# Altium schematic sheet conect_sheet.SchDoc
size 420 x 297 mm; DocumentNumber: Connectors
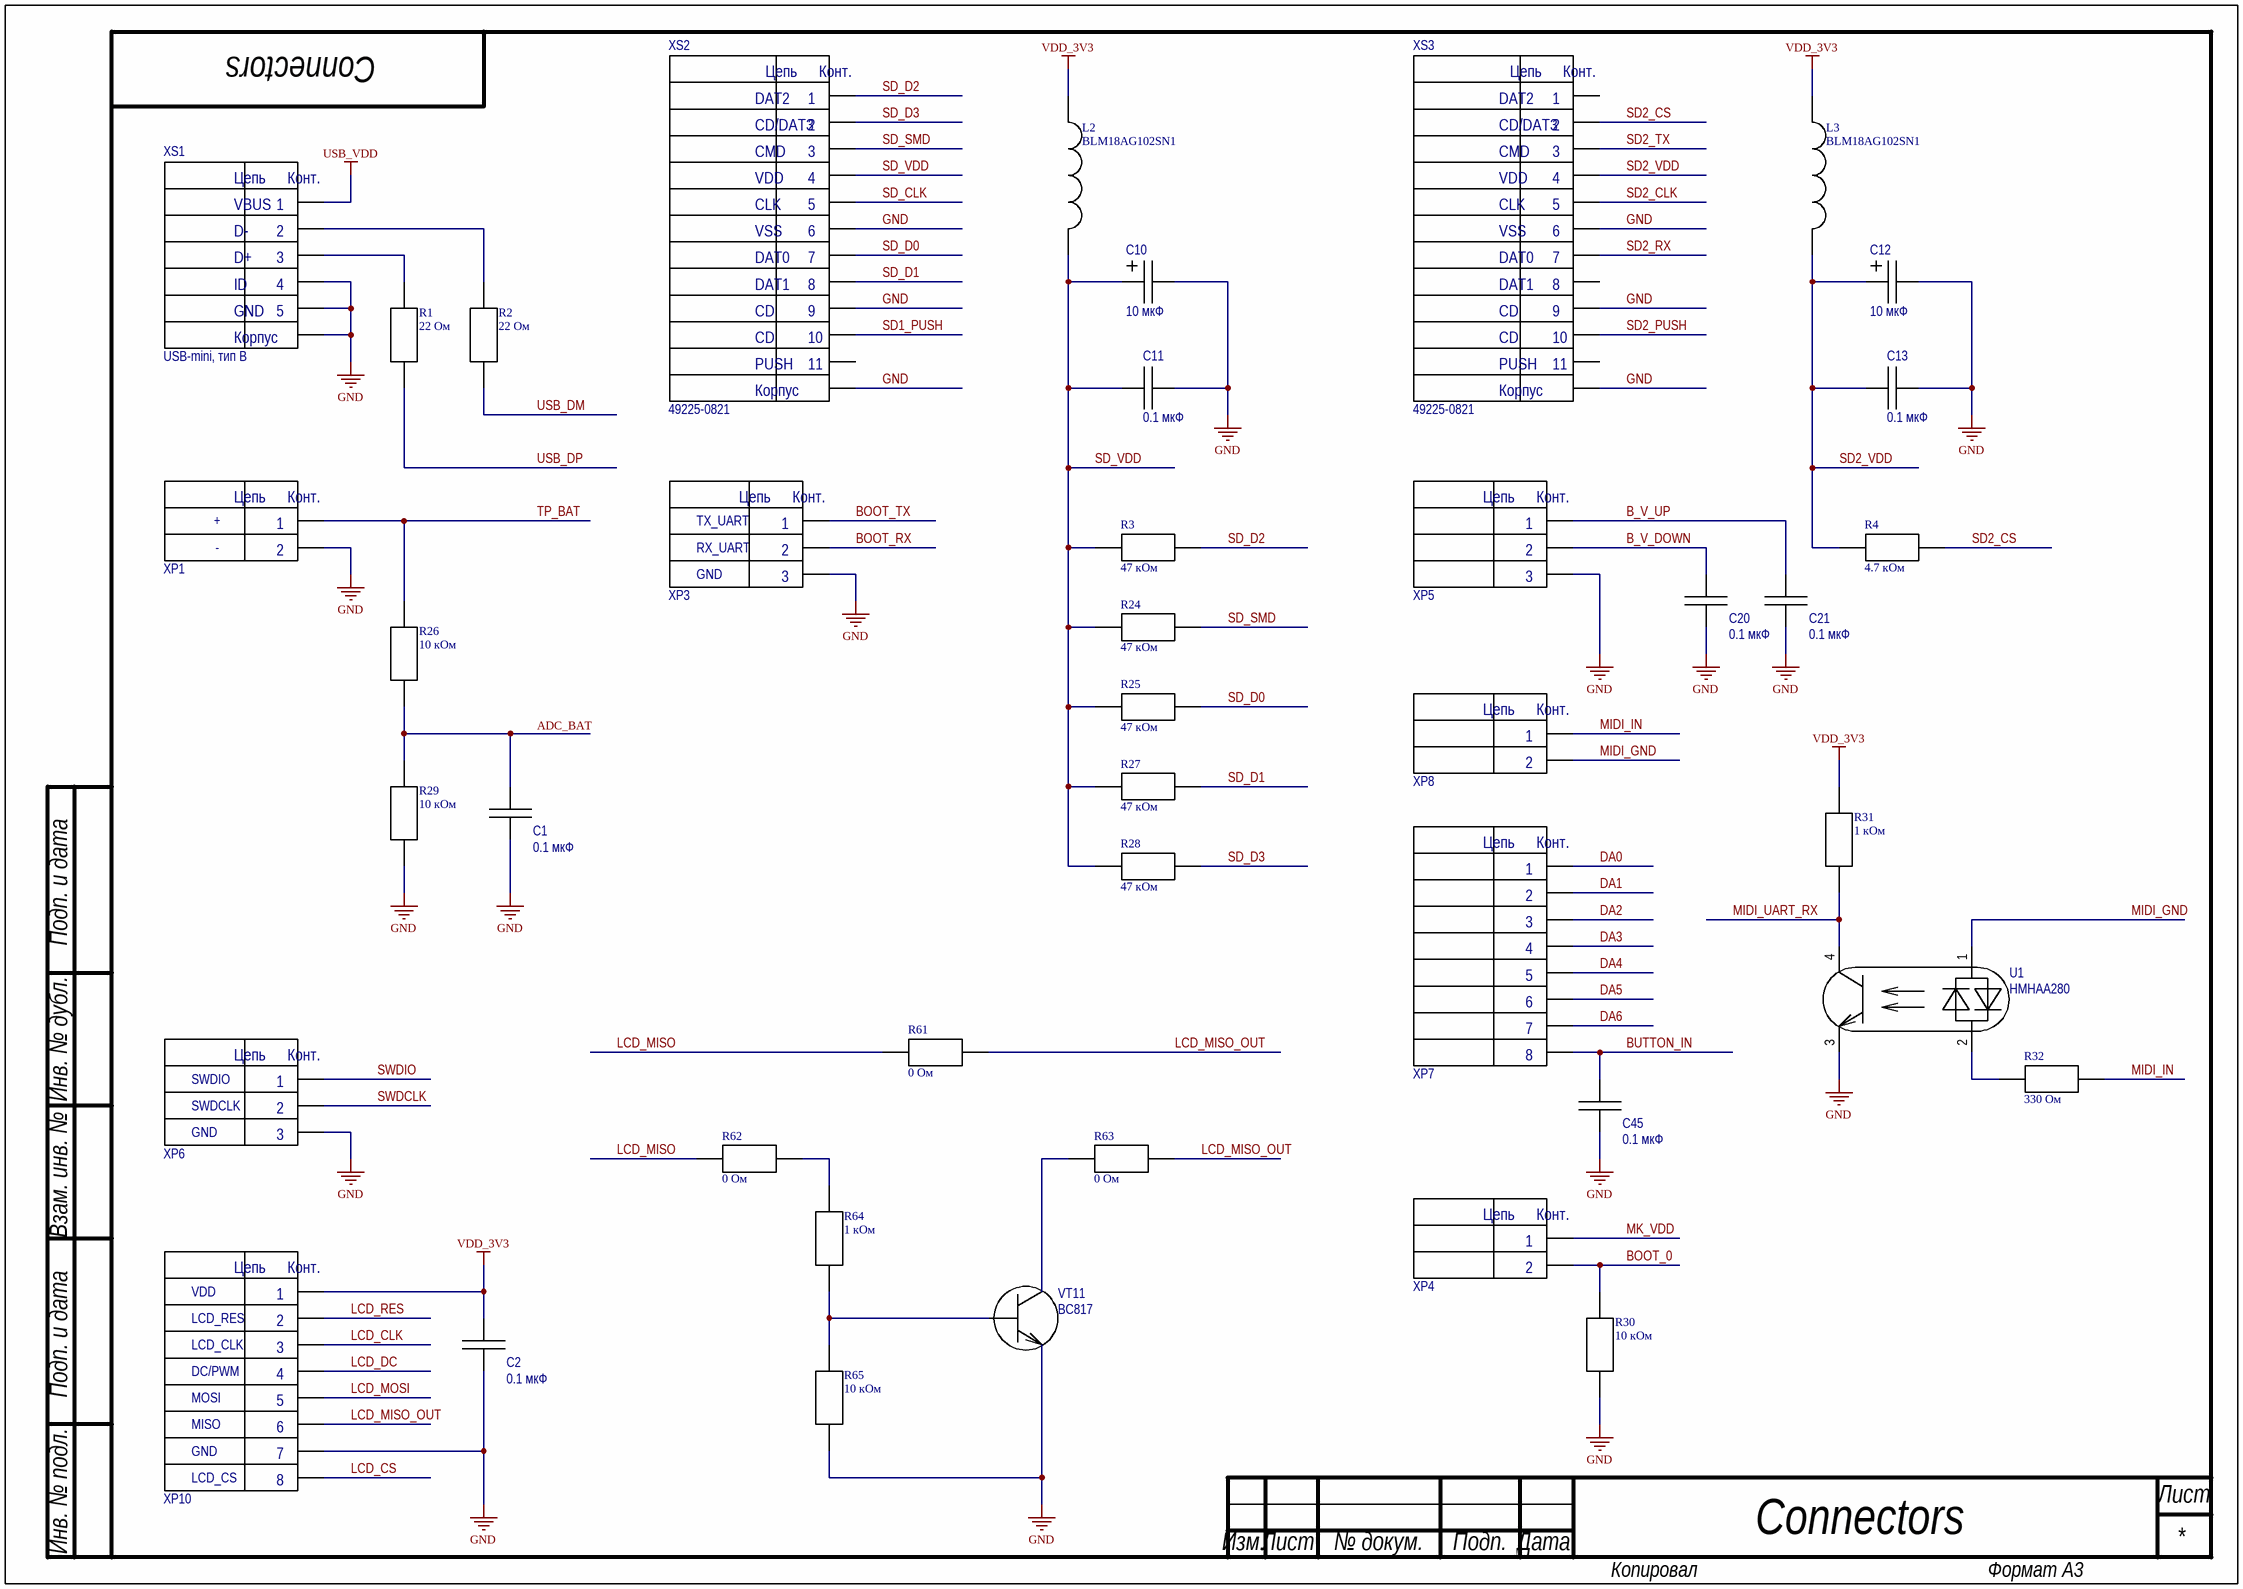
[diagram p0: conect_sheet.SchDoc]

## Parts
C1  0.1 мкФ  [C 1206]
C2  0.1 мкФ  [C 1206]
C10  10 мкФ  [C TAN_C]
C11  0.1 мкФ  [C 1206]
C12  10 мкФ  [C TAN_C]
C13  0.1 мкФ  [C 1206]
C20  0.1 мкФ  [C 1206]
C21  0.1 мкФ  [C 1206]
C45  0.1 мкФ  [C 1206]
L2  BLM18AG102SN1  [FB 0603]
L3  BLM18AG102SN1  [FB 0603]
R1  22 Ом  [RES 0805]
R2  22 Ом  [RES 0805]
R3  47 кОм  [RES 0805]
R4  4.7 кОм  [RES 0805]
R24  47 кОм  [RES 0805]
R25  47 кОм  [RES 0805]
R26  10 кОм  [RES 0805]
R27  47 кОм  [RES 0805]
R28  47 кОм  [RES 0805]
R29  10 кОм  [RES 0805]
R30  10 кОм  [RES 0805]
R31  1 кОм  [RES 0805]
R32  330 Ом  [RES 0805]
R61  0 Ом  [RES 0805]
R62  0 Ом  [RES 0805]
R63  0 Ом  [RES 0805]
R64  1 кОм  [RES 0805]
R65  10 кОм  [RES 0805]
U1  HMHAA280  [MFP-4L]
VT11  BC817  [SOT-23]
XP1  PLS-2  [PLS-2]  (value not drawn)
XP3  PLS-3  [PLS-3]  (value not drawn)
XP4  PLS-2  [PLS-2]  (value not drawn)
XP5  PLS-3  [PLS-3]  (value not drawn)
XP6  PLS-3  [PLS-3]  (value not drawn)
XP7  PLD-8  [PLD-8]  (value not drawn)
XP8  PLS-2  [PLS-2]  (value not drawn)
XP10  PLD-8  [PLD-8]  (value not drawn)
XS1  USB-mini, тип B  [USB_mini_B]
XS2  49225-0821  [MOLEX 49225-0821]
XS3  49225-0821  [MOLEX 49225-0821]

## Nets
GND: C1.2 C2.2 C10.2 C11.2 C12.2 C13.2 C20.2 C21.2 C45.2 R29.1 R30.1 R65.1 U1.3(E) VT11.2(E) XP1.2 XP3.3 XP5.3 XP6.3 XP10.7 XS1.0 XS1.4(CASE) XS1.5(GND) XS2.0 XS2.6 XS2.9 XS3.0 XS3.6 XS3.9
USB_VDD: XS1.1(VBUS)
VDD_3V3: C2.1 L2.1 L3.1 R31.2 XP10.1
ADC_BAT: C1.1 R26.1 R29.2
B_V_DOWN: C20.1 XP5.2
B_V_UP: C21.1 XP5.1
BOOT_0: R30.2 XP4.2
BOOT_RX: XP3.2
BOOT_TX: XP3.1
BUTTON_IN: C45.1 XP7.8
DA0: XP7.1
DA1: XP7.2
DA2: XP7.3
DA3: XP7.4
DA4: XP7.5
DA5: XP7.6
DA6: XP7.7
LCD_CLK: XP10.3
LCD_CS: XP10.8
LCD_DC: XP10.4
LCD_MISO: R61.1 R62.2
LCD_MISO_OUT: R61.2 R63.1 XP10.6
LCD_MOSI: XP10.5
LCD_RES: XP10.2
MIDI_GND: U1.1(AC) XP8.2
MIDI_IN: R32.2 XP8.1
MIDI_UART_RX: R31.1 U1.4(C)
MK_VDD: XP4.1
SD1_PUSH: XS2.10
SD2_CLK: XS3.5
SD2_CS: R4.2 XS3.2
SD2_PUSH: XS3.10
SD2_RX: XS3.7
SD2_TX: XS3.3
SD2_VDD: C12.1 C13.1 L3.2 R4.1 XS3.4
SD_CLK: XS2.5
SD_D0: R25.2 XS2.7
SD_D1: R27.2 XS2.8
SD_D2: R3.2 XS2.1
SD_D3: R28.2 XS2.2
SD_SMD: R24.2 XS2.3
SD_VDD: C10.1 C11.1 L2.2 R3.1 R24.1 R25.1 R27.1 R28.1 XS2.4
SWDCLK: XP6.2
SWDIO: XP6.1
TP_BAT: R26.2 XP1.1
USB_DM: R2.1
USB_DP: R1.1
NetR1_2: R1.2 XS1.3(D+)
NetR2_2: R2.2 XS1.2(D-)
NetR32_1: R32.1 U1.2(CA)
NetR62_1: R62.1 R64.2
NetR63_2: R63.2 VT11.3(C)
NetR64_1: R64.1 R65.2 VT11.1(B)

Not connected (* = marked no-connect by the designer): XS2 11; XS3 1 8 11

## Notes on the sheet
- +
- TX_UART
- -
- RX_UART
- GND
- SWDIO
- SWDCLK
- VDD
- LCD_RES
- LCD_CLK
- MOSI
- DC/PWM
- LCD_CS
- MISO
- Подп. и дата
- Инв. № дубл.
- Взам. инв. №
- Инв. № подл.
- Лист
- Изм.
- № докум.
- Подп.
- Дата
- Копировал
- Формат А3
- (in symbol 49225-0821) Цепь; Конт.; DAT2; CD/DAT3; CMD; VDD; CLK; VSS; DAT0; DAT1; CD; PUSH; Корпус
- (in symbol PLD-8) Цепь; Конт.
- (in symbol PLS-2) Цепь; Конт.
- (in symbol PLS-3) Цепь; Конт.
- (in symbol USB-mini_B) Цепь; Конт.; ID; Корпус

## Library data of the parts
C1 C2 C11 C13 C20 C21 C45 = CAP 1206: SMD Capacitor 1206; Manufacturer: /Укажите компанию-производителя/; Tolerance: /Укажите допуск в процентах/; Temperature coefficient: /Формат: ±? ppm/°C/; Type: Конденсатор керамический; TC: /Укажите тип диэлектрика/; Size: 1206; Temperature range: /Формат: -? ... ? °C/; Value: 0.1 мкФ
C10 C12 = CAP TAN_C: SMD Tantalium Capacitor C; Manufacturer: /Укажите компанию-производителя/; Tolerance: /Укажите допуск в процентах/; Type: Конденсатор танталовый; ESR: /Укажите значение ЭПС/; Size: C; Temperature range: /Формат: -? ... ? °C/; Value: 10 мкФ
R1-R4 R24-R32 R61-R65 = RES 0805
U1 = HMHAA280: AC Input Half Pitch Mini-Flat Package 4-pin Optocoupler; Manufacturer: Fairchild Semiconductor; Emitter forward voltage: 1,4 В; Emitter power dissitipation: 60 мВт; Isolation voltage: 3750 В; Detector collector current: 50 мА; Emitter reverse voltage: 6 В; Detector collector-emitter voltage: 80 В; Detector power dissitipation: 150 мВт; Temperature range: -55 ... 100 °C; Type: Оптрон; Emitter forward current: 50 мА
VT11 = BC817: NPN general-purpose transistor; Manufacturer: NXP; Structure: n-p-n; Type: Транзистор биполярный; hFE: 160 ... 600; Max collector-emitter voltage: 45 В; Max collector-base voltage: 50 В; Max emitter-base voltage: 5 В; Max collector current: 0,5 А; Max collector peak current: 1 А; Power dissitipation: 0,25 Вт; fT: 100 МГц; Collector-emitter saturation voltage: 0,7 В; Base-emitter on voltage: 1,2 В; Specitication: ЭКБ ИП; Collector-base сapacitance: 3 пФ; Complement: BC807; Temperature range: -65 ... 150 °C
XP1 XP4 XP8 = PLS-2: PLS connector; Manufacturer: NONAME; Connector type: Вилка на плату; Number of contacts: 2; Type: Разъем штыревой
XP3 XP5 XP6 = PLS-3: PLS connector; Manufacturer: NONAME; Connector type: Вилка на плату; Number of contacts: 3; Type: Разъем штыревой
XP7 XP10 = PLD-8: PLD connector; Manufacturer: NONAME; Connector type: Вилка на плату; Number of contacts: 8; Type: Разъем штыревой
XS1 = USB-mini_B: USB-mini-B connector; Manufacturer: NONAME; Connector type: USB-mini, тип B на плату; Number of contacts: 5; Type: Разъем
XS2 XS3 = 49225-0821: MOLEX MicroSD connector; Connector type: Разъем MicroSD на плату; Number of contacts: 11; Manufacturer: Molex; Type: Разъем